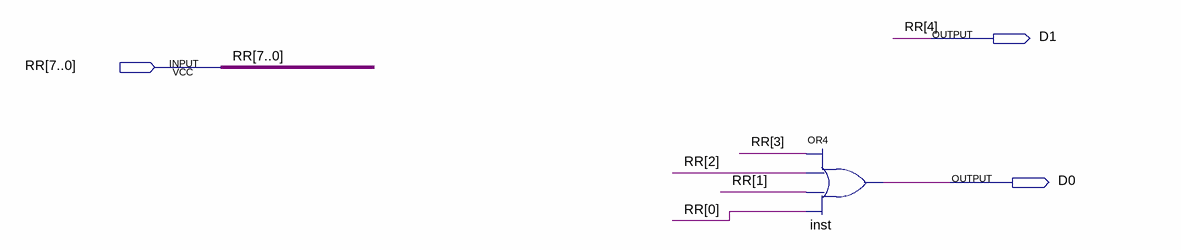
[diagram p0: schematic sheet]
// Quartus schematic KC3.bdf as structural Verilog: 1 symbols, 3 pins
module KC3 (
  input  [7:0] RR,
  output D1,
  output D0
);

  or inst (D0, RR[3], RR[2], RR[1], RR[0]);

  assign D1 = RR[4];
endmodule
